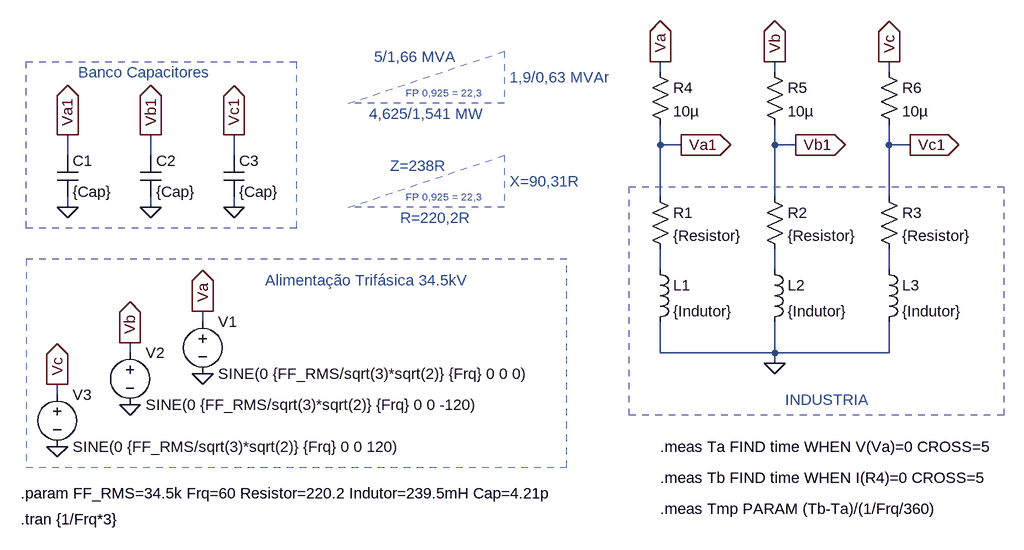
[diagram p0: schematic FatorPotenciaCase.asc]
FatorPotenciaCase.asc, the LTspice schematic file:
Version 4
SHEET 1 2160 680
WIRE 832 -128 832 -144
WIRE 1008 -128 1008 -144
WIRE 1184 -128 1184 -144
WIRE 832 -16 832 -48
WIRE 864 -16 832 -16
WIRE 1008 -16 1008 -48
WIRE 1040 -16 1008 -16
WIRE 1184 -16 1184 -48
WIRE 1216 -16 1184 -16
WIRE -80 0 -80 -32
WIRE 48 0 48 -32
WIRE 176 0 176 -32
WIRE 832 64 832 -16
WIRE 1008 64 1008 -16
WIRE 1184 64 1184 -16
WIRE -80 80 -80 64
WIRE 48 80 48 64
WIRE 176 80 176 64
WIRE 832 176 832 144
WIRE 1008 176 1008 144
WIRE 1184 176 1184 144
WIRE 128 256 128 240
WIRE 16 304 16 288
WIRE 832 304 832 256
WIRE 1008 304 1008 256
WIRE 1008 304 832 304
WIRE 1184 304 1184 256
WIRE 1184 304 1008 304
WIRE 1008 320 1008 304
WIRE -96 368 -96 352
FLAG 128 336 0
FLAG 128 240 Va
IOPIN 128 240 Out
FLAG 16 384 0
FLAG 16 288 Vb
IOPIN 16 288 Out
FLAG -96 448 0
FLAG -96 352 Vc
IOPIN -96 352 Out
FLAG 1008 320 0
FLAG 832 -144 Va
IOPIN 832 -144 Out
FLAG 1008 -144 Vb
IOPIN 1008 -144 Out
FLAG 1184 -144 Vc
IOPIN 1184 -144 Out
FLAG -80 80 0
FLAG 48 80 0
FLAG 176 80 0
FLAG -80 -32 Va1
IOPIN -80 -32 Out
FLAG 48 -32 Vb1
IOPIN 48 -32 Out
FLAG 176 -32 Vc1
IOPIN 176 -32 Out
FLAG 864 -16 Va1
IOPIN 864 -16 Out
FLAG 1040 -16 Vb1
IOPIN 1040 -16 Out
FLAG 1216 -16 Vc1
IOPIN 1216 -16 Out
SYMBOL voltage 128 240 R0
WINDOW 123 0 0 Left 0
WINDOW 39 0 0 Left 0
SYMATTR InstName V1
SYMATTR Value SINE(0 {FF_RMS/sqrt(3)*sqrt(2)} {Frq} 0 0 0)
SYMBOL voltage 16 288 R0
WINDOW 123 0 0 Left 0
WINDOW 39 0 0 Left 0
SYMATTR InstName V2
SYMATTR Value SINE(0 {FF_RMS/sqrt(3)*sqrt(2)} {Frq} 0 0 -120)
SYMBOL voltage -96 352 R0
WINDOW 123 0 0 Left 0
WINDOW 39 0 0 Left 0
SYMATTR InstName V3
SYMATTR Value SINE(0 {FF_RMS/sqrt(3)*sqrt(2)} {Frq} 0 0 120)
SYMBOL ind 816 160 R0
SYMATTR InstName L1
SYMATTR Value {Indutor}
SYMBOL ind 992 160 R0
SYMATTR InstName L2
SYMATTR Value {Indutor}
SYMBOL ind 1168 160 R0
SYMATTR InstName L3
SYMATTR Value {Indutor}
SYMBOL res 816 48 R0
SYMATTR InstName R1
SYMATTR Value {Resistor}
SYMBOL res 992 48 R0
SYMATTR InstName R2
SYMATTR Value {Resistor}
SYMBOL res 1168 48 R0
SYMATTR InstName R3
SYMATTR Value {Resistor}
SYMBOL cap -96 0 R0
SYMATTR InstName C1
SYMATTR Value {Cap}
SYMBOL cap 32 0 R0
SYMATTR InstName C2
SYMATTR Value {Cap}
SYMBOL cap 160 0 R0
SYMATTR InstName C3
SYMATTR Value {Cap}
SYMBOL res 816 -144 R0
SYMATTR InstName R4
SYMATTR Value 10µ
SYMBOL res 992 -144 R0
SYMATTR InstName R5
SYMATTR Value 10µ
SYMBOL res 1168 -144 R0
SYMATTR InstName R6
SYMATTR Value 10µ
TEXT -152 520 Left 2 !.param FF_RMS=34.5k Frq=60 Resistor=220.2 Indutor=239.5mH Cap=4.21p
TEXT -152 560 Left 2 !.tran {1/Frq*3}
TEXT 832 448 Left 2 !.meas Ta FIND time WHEN V(Va)=0 CROSS=5
TEXT 832 496 Left 2 !.meas Tb FIND time WHEN I(R4)=0 CROSS=5
TEXT 832 544 Left 2 !.meas Tmp PARAM (Tb-Ta)/(1/Frq/360)
TEXT -64 -128 Left 2 ;Banco Capacitores
TEXT 1024 376 Left 2 ;INDUSTRIA
TEXT 224 192 Left 2 ;Alimentação Trifásica 34.5kV
TEXT 392 -152 Left 2 ;5/1,66 MVA
TEXT 384 -64 Left 2 ;4,625/1,541 MW
TEXT 600 -120 Left 2 ;1,9/0,63 MVAr
TEXT 416 16 Left 2 ;Z=238R
TEXT 432 96 Left 2 ;R=220,2R
TEXT 600 40 Left 2 ;X=90,31R
TEXT 440 -96 Left 1 ;FP 0,925 = 22,3
TEXT 440 64 Left 1 ;FP 0,925 = 22,3
LINE Normal 592 -80 352 -80 2
LINE Normal 592 -160 592 -80 2
LINE Normal 352 -80 592 -160 2
LINE Normal 592 80 352 80 2
LINE Normal 592 0 592 80 2
LINE Normal 352 80 592 0 2
RECTANGLE Normal 272 112 -144 -144 2
RECTANGLE Normal 688 160 -144 480 2
RECTANGLE Normal 1360 400 784 48 2

The netlist it stands for:
* FatorPotenciaCase.asc
V1 Va 0 SINE(0 {FF_RMS/sqrt(3)*sqrt(2)} {Frq} 0 0 0)
V2 Vb 0 SINE(0 {FF_RMS/sqrt(3)*sqrt(2)} {Frq} 0 0 -120)
V3 Vc 0 SINE(0 {FF_RMS/sqrt(3)*sqrt(2)} {Frq} 0 0 120)
L1 N001 0 {Indutor}
L2 N002 0 {Indutor}
L3 N003 0 {Indutor}
R1 Va1 N001 {Resistor}
R2 Vb1 N002 {Resistor}
R3 Vc1 N003 {Resistor}
C1 Va1 0 {Cap}
C2 Vb1 0 {Cap}
C3 Vc1 0 {Cap}
R4 Va Va1 10µ
R5 Vb Vb1 10µ
R6 Vc Vc1 10µ
.param FF_RMS=34.5k Frq=60 Resistor=220.2 Indutor=239.5mH Cap=4.21p
.tran {1/Frq*3}
.meas Ta FIND time WHEN V(Va)=0 CROSS=5
.meas Tb FIND time WHEN I(R4)=0 CROSS=5
.meas Tmp PARAM (Tb-Ta)/(1/Frq/360)
* Banco Capacitores
* INDUSTRIA
* Alimentação Trifásica 34.5kV
* 5/1,66 MVA
* 4,625/1,541 MW
* 1,9/0,63 MVAr
* Z=238R
* R=220,2R
* X=90,31R
* FP 0,925 = 22,3
* FP 0,925 = 22,3
.backanno
.end